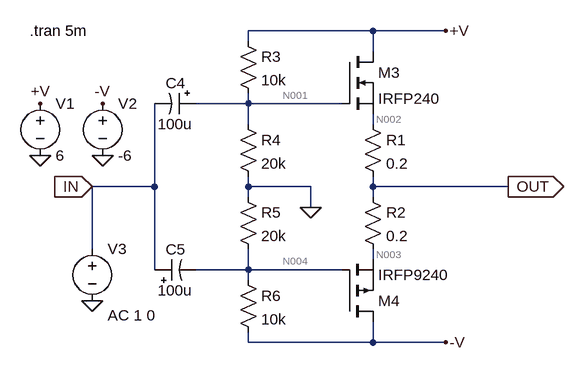
[diagram p0: schematic Circuit7_23.asc]
Circuit7_23.asc, the LTspice schematic file:
Version 4
SHEET 1 1092 680
WIRE 80 80 -112 80
WIRE 192 80 80 80
WIRE -112 96 -112 80
WIRE 80 112 80 80
WIRE -112 192 -112 176
WIRE -112 192 -192 192
WIRE 32 192 -112 192
WIRE -112 224 -112 192
WIRE 80 224 80 208
WIRE -256 320 -256 192
WIRE -256 320 -352 320
WIRE -112 320 -112 304
WIRE -16 320 -112 320
WIRE 80 320 80 304
WIRE 288 320 80 320
WIRE -112 336 -112 320
WIRE 80 336 80 320
WIRE -16 352 -16 320
WIRE -352 416 -352 320
WIRE 80 432 80 416
WIRE -256 448 -256 320
WIRE -112 448 -112 416
WIRE -112 448 -192 448
WIRE 32 448 -112 448
WIRE -112 464 -112 448
WIRE -112 560 -112 544
WIRE 80 560 80 528
WIRE 80 560 -112 560
WIRE 192 560 80 560
FLAG -432 272 0
FLAG -336 272 0
FLAG -352 496 0
FLAG 192 80 +V
FLAG -432 192 +V
FLAG 192 560 -V
FLAG -336 192 -V
FLAG -352 320 IN
IOPIN -352 320 In
FLAG 288 320 OUT
IOPIN 288 320 Out
FLAG -16 352 0
SYMBOL res 64 208 R0
SYMATTR InstName R1
SYMATTR Value 0.2
SYMBOL res 64 320 R0
SYMATTR InstName R2
SYMATTR Value 0.2
SYMBOL res -128 80 R0
SYMATTR InstName R3
SYMATTR Value 10k
SYMBOL res -128 208 R0
SYMATTR InstName R4
SYMATTR Value 20k
SYMBOL res -128 448 R0
SYMATTR InstName R6
SYMATTR Value 10k
SYMBOL voltage -432 176 R0
SYMATTR InstName V1
SYMATTR Value 6
SYMBOL voltage -336 176 R0
SYMATTR InstName V2
SYMATTR Value -6
SYMBOL voltage -352 400 R0
WINDOW 3 24 96 Invisible 2
WINDOW 123 24 118 Left 2
SYMATTR Value SINE(0 1 1K)
SYMATTR Value2 AC 1 0
SYMATTR InstName V3
SYMBOL res -128 320 R0
SYMATTR InstName R5
SYMATTR Value 20k
SYMBOL nmos 32 112 R0
SYMATTR InstName M3
SYMATTR Value IRFP240
SYMBOL pmos 32 528 M180
SYMATTR InstName M4
SYMATTR Value IRFP9240
SYMBOL polcap -192 176 R90
WINDOW 0 0 32 VBottom 2
WINDOW 3 32 32 VTop 2
SYMATTR InstName C4
SYMATTR Value 100u
SYMBOL polcap -256 464 R270
WINDOW 0 32 32 VTop 2
WINDOW 3 0 32 VBottom 2
SYMATTR InstName C5
SYMATTR Value 100u
TEXT -448 80 Left 2 !.tran 5m

The netlist it stands for:
* Circuit7_23.asc
R1 N002 OUT 0.2
R2 OUT N003 0.2
R3 +V N001 10k
R4 N001 0 20k
R6 N004 -V 10k
V1 +V 0 6
V2 -V 0 -6
V3 IN 0 SINE(0 1 1K) AC 1 0
R5 0 N004 20k
M3 +V N001 N002 N002 IRFP240
M4 -V N004 N003 N003 IRFP9240
C4 N001 IN 100u
C5 IN N004 100u
.model NMOS NMOS
.model PMOS PMOS
.lib standard.mos
.tran 5m
.backanno
.end

* Results of the author's LTspice run, read from the files saved beside the schematic
* Operating Point, zero values left out:
*   V(n002) = -23.86 mV
*   V(out) = -27.73 mV
*   V(n003) = -31.59 mV
*   V(+v) = 6 V
*   V(n001) = 4 V
*   V(n004) = -4 V
*   V(-v) = -6 V
*   Id(M4) = -19.34 mA
*   Is(M4) = 19.34 mA
*   Id(M3) = 19.34 mA
*   Is(M3) = -19.34 mA
*   I(R5) = 200 µA
*   I(R6) = 200 µA
*   I(R4) = 200 µA
*   I(R3) = 200 µA
*   I(R2) = 19.34 mA
*   I(R1) = 19.34 mA
*   I(V2) = 19.54 mA
*   I(V1) = -19.54 mA
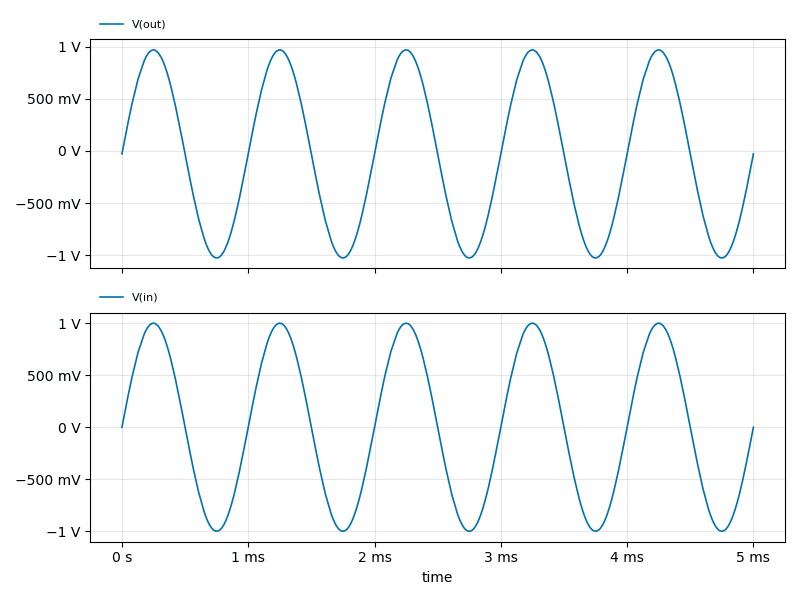
[diagram p1: Transient Analysis of Circuit7_23.asc, plotted from the saved traces]
* Transient Analysis, 1 run:
*   V(out): min -1.025 V, max 968.4 mV, average -28.2 mV, rms 706.1 mV, last -27.74 mV
*   V(in): min -1 V, max 999.5 mV, average -266.6 µV, rms 707.8 mV, last 0 V